# Altium schematic sheet 7g - Current FB Protection.SchDoc
size 304 x 193 mm
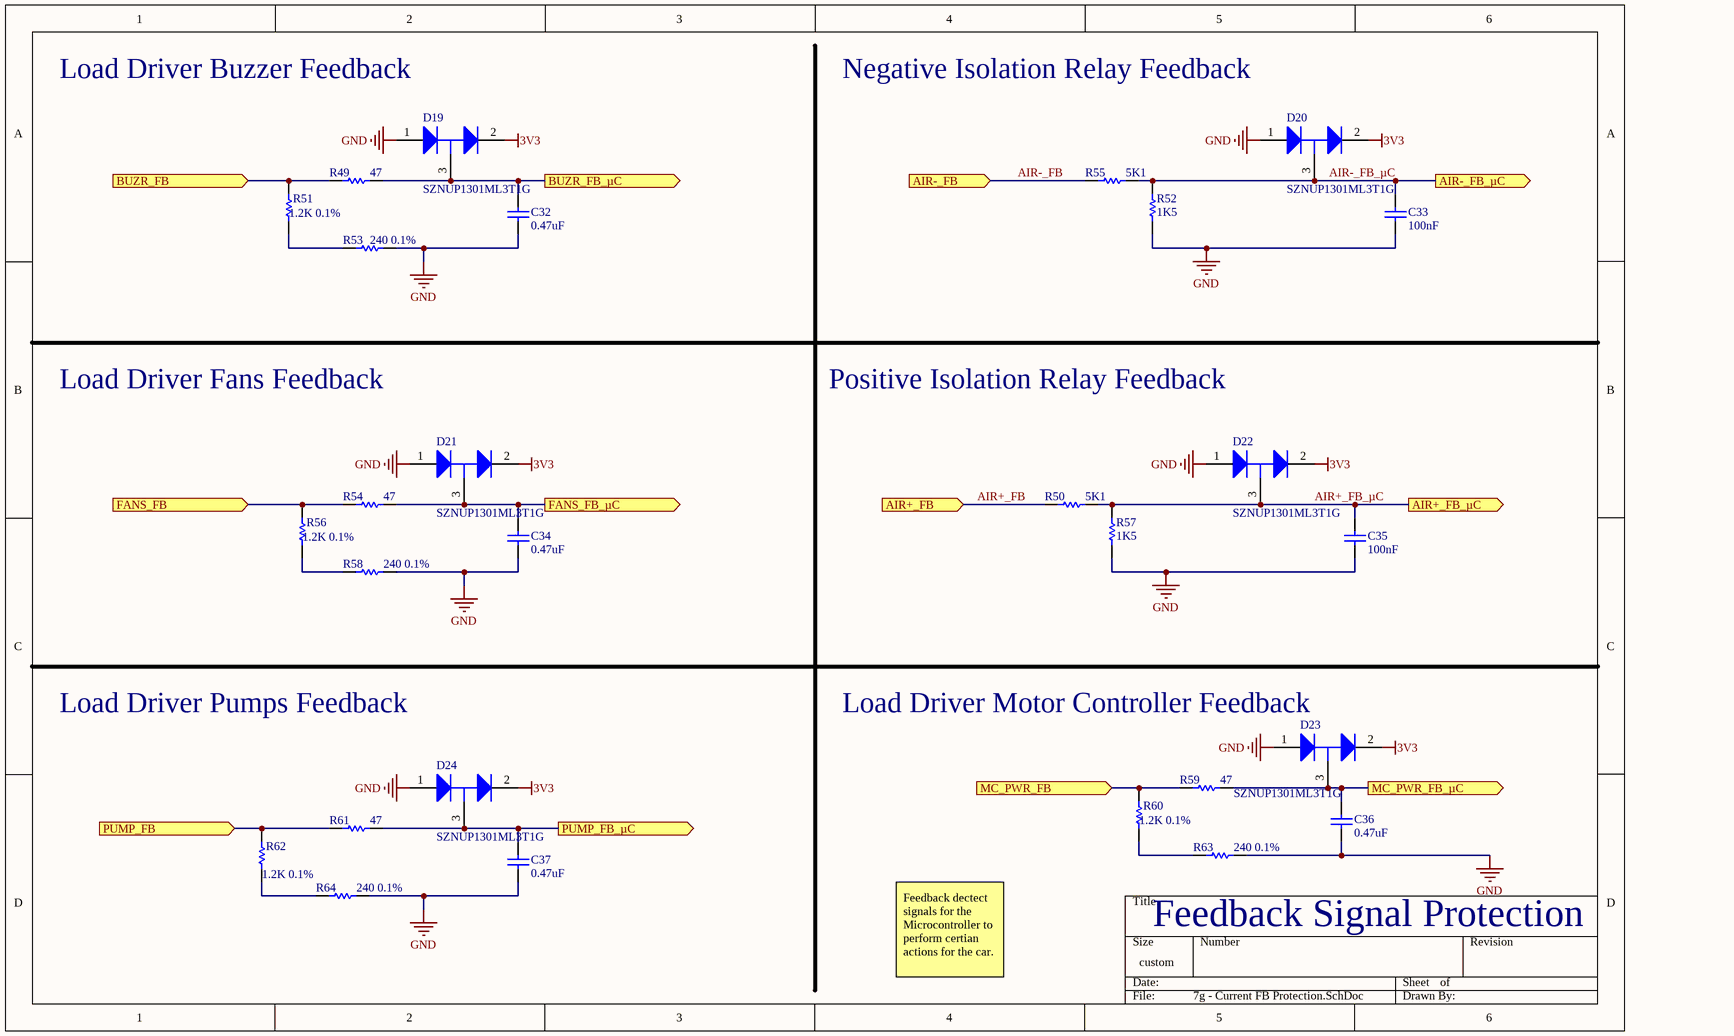
[diagram p0: 7g - Current FB Protection.SchDoc]

## Parts
C32  value 0.47uF  [1608[0603]]  (hidden comment: Cap)
C33  value 100nF  [1608[0603]]  (hidden comment: Cap)
C34  value 0.47uF  [1608[0603]]  (hidden comment: Cap)
C35  value 100nF  [1608[0603]]  (hidden comment: Cap)
C36  value 0.47uF  [1608[0603]]  (hidden comment: Cap)
C37  value 0.47uF  [1608[0603]]  (hidden comment: Cap)
D19  SZNUP1301ML3T1G  [ONSC-SOT-23-3-318-08_V]
D20  SZNUP1301ML3T1G  [ONSC-SOT-23-3-318-08_V]
D21  SZNUP1301ML3T1G  [ONSC-SOT-23-3-318-08_V]
D22  SZNUP1301ML3T1G  [ONSC-SOT-23-3-318-08_V]
D23  SZNUP1301ML3T1G  [ONSC-SOT-23-3-318-08_V]
D24  SZNUP1301ML3T1G  [ONSC-SOT-23-3-318-08_V]
R49  value 47  [1608[0603]]  (hidden comment: Res1)
R50  value 5K1  [1608[0603]]  (hidden comment: Res1)
R51  value 1.2K 0.1%  [1608[0603]]  (hidden comment: Res1)
R52  value 1K5  [1608[0603]]  (hidden comment: Res1)
R53  value 240 0.1%  [1608[0603]]  (hidden comment: Res1)
R54  value 47  [1608[0603]]  (hidden comment: Res1)
R55  value 5K1  [1608[0603]]  (hidden comment: Res1)
R56  value 1.2K 0.1%  [1608[0603]]  (hidden comment: Res1)
R57  value 1K5  [1608[0603]]  (hidden comment: Res1)
R58  value 240 0.1%  [1608[0603]]  (hidden comment: Res1)
R59  value 47  [1608[0603]]  (hidden comment: Res1)
R60  value 1.2K 0.1%  [1608[0603]]  (hidden comment: Res1)
R61  value 47  [1608[0603]]  (hidden comment: Res1)
R62  value 1.2K 0.1%  [1608[0603]]  (hidden comment: Res1)
R63  value 240 0.1%  [1608[0603]]  (hidden comment: Res1)
R64  value 240 0.1%  [1608[0603]]  (hidden comment: Res1)

## Ports
AIR+_FB (in), AIR+_FB_µC (out), AIR-_FB (in), AIR-_FB_µC (out), BUZR_FB (in), BUZR_FB_µC (out), FANS_FB (in), FANS_FB_µC (out), MC_PWR_FB (in), MC_PWR_FB_µC (out), PUMP_FB (in), PUMP_FB_µC (out)

## Nets
3V3: D19.2(K) D20.2(K) D21.2(K) D22.2(K) D23.2(K) D24.2(K)
GND: C32.1 C33.1 C34.1 C35.1 C36.1 C37.1 D19.1(A) D20.1(A) D21.1(A) D22.1(A) D23.1(A) D24.1(A) R52.1 R53.2 R57.1 R58.2 R63.2 R64.2
AIR+_FB: R50.1 ; port AIR+_FB
AIR+_FB_µC: C35.2 D22.3(K/A) R50.2 R57.2 ; port AIR+_FB_µC
AIR-_FB: R55.1 ; port AIR-_FB
AIR-_FB_µC: C33.2 D20.3(K/A) R52.2 R55.2 ; port AIR-_FB_µC
BUZR_FB: R49.1 R51.2 ; port BUZR_FB
BUZR_FB_µC: C32.2 D19.3(K/A) R49.2 ; port BUZR_FB_µC
FANS_FB: R54.1 R56.2 ; port FANS_FB
FANS_FB_µC: C34.2 D21.3(K/A) R54.2 ; port FANS_FB_µC
MC_PWR_FB: R59.1 R60.2 ; port MC_PWR_FB
MC_PWR_FB_µC: C36.2 D23.3(K/A) R59.2 ; port MC_PWR_FB_µC
PUMP_FB: R61.1 R62.2 ; port PUMP_FB
PUMP_FB_µC: C37.2 D24.3(K/A) R61.2 ; port PUMP_FB_µC
NetR51_1: R51.1 R53.1
NetR56_1: R56.1 R58.1
NetR60_1: R60.1 R63.1
NetR62_1: R62.1 R64.1

## Notes on the sheet
- Load Driver Buzzer Feedback
- Negative Isolation Relay Feedback
- Load Driver Fans Feedback
- Positive Isolation Relay Feedback
- Load Driver Pumps Feedback
- (near D23) Load Driver Motor Controller Feedback
- Feedback dectect signals for the Microcontroller to perform certian actions for the car.
- (near R63) Feedback Signal Protection

## Library data of the parts
C32-C37 = Cap: Capacitor; Published: 8-Jun-2000; LatestRevisionDate: 17-Jul-2002; LatestRevisionNote: Re-released for DXP Platform.; PackageReference: RAD-0.3; Publisher: Altium Limited; PackageDescription: Radial Cap, Thru-Hole; 2 Leads; 0.3 in Pin Spacing
D19-D24 = CMP-1063-00171-1: Low Capacitance Diode Array for ESD Protection in a Single Data Line, 3-Pin SOT-23, Pb-Free, Tape and Reel; Manufacturer: On Semiconductor; C Max (pF): 0.9; Direction: Bidirectional; V(BR) Min (V): 70; Number of Lines: 1; Mounting Technology: Surface Mount; PackageReference: SOT-23-3-318-08; DatasheetVersion: Rev. 6; PackageVersion: Rev. AP, 11/2009; RoHS: Pb-Free; ComponentLink1Description: Manufacturer URL; ComponentLink1URL: http://www.onsemi.com/; PackageDescription: 3-Pin Small Outline Transistor, Body 2.92 x 1.3 mm, Pitch 0.95 mm; PartNumber: SZNUP1301ML3T1G; Packing: Tape and Reel; ComponentLink3URL: http://www.onsemi.cn/pub_link/Collateral/318-08.PDF; ComponentLink3Description: Package Specification; VRWM Max (V): 70; ComponentLink2Description: Datasheet; ComponentLink2URL: http://www.onsemi.cn/pub_link/Collateral/NUP1301ML3T1-D.PDF
R49-R64 = Res1: Resistor; Published: 8-Jun-2000; LatestRevisionDate: 17-Jul-2002; LatestRevisionNote: Re-released for DXP Platform.; PackageReference: AXIAL-0.3; Publisher: Altium Limited; PackageDescription: Axial Device, Thru-Hole; 2 Leads; 0.3 in Pin Spacing